# EAGLE design daq-beaglebone (EAGLE 7.3.0)
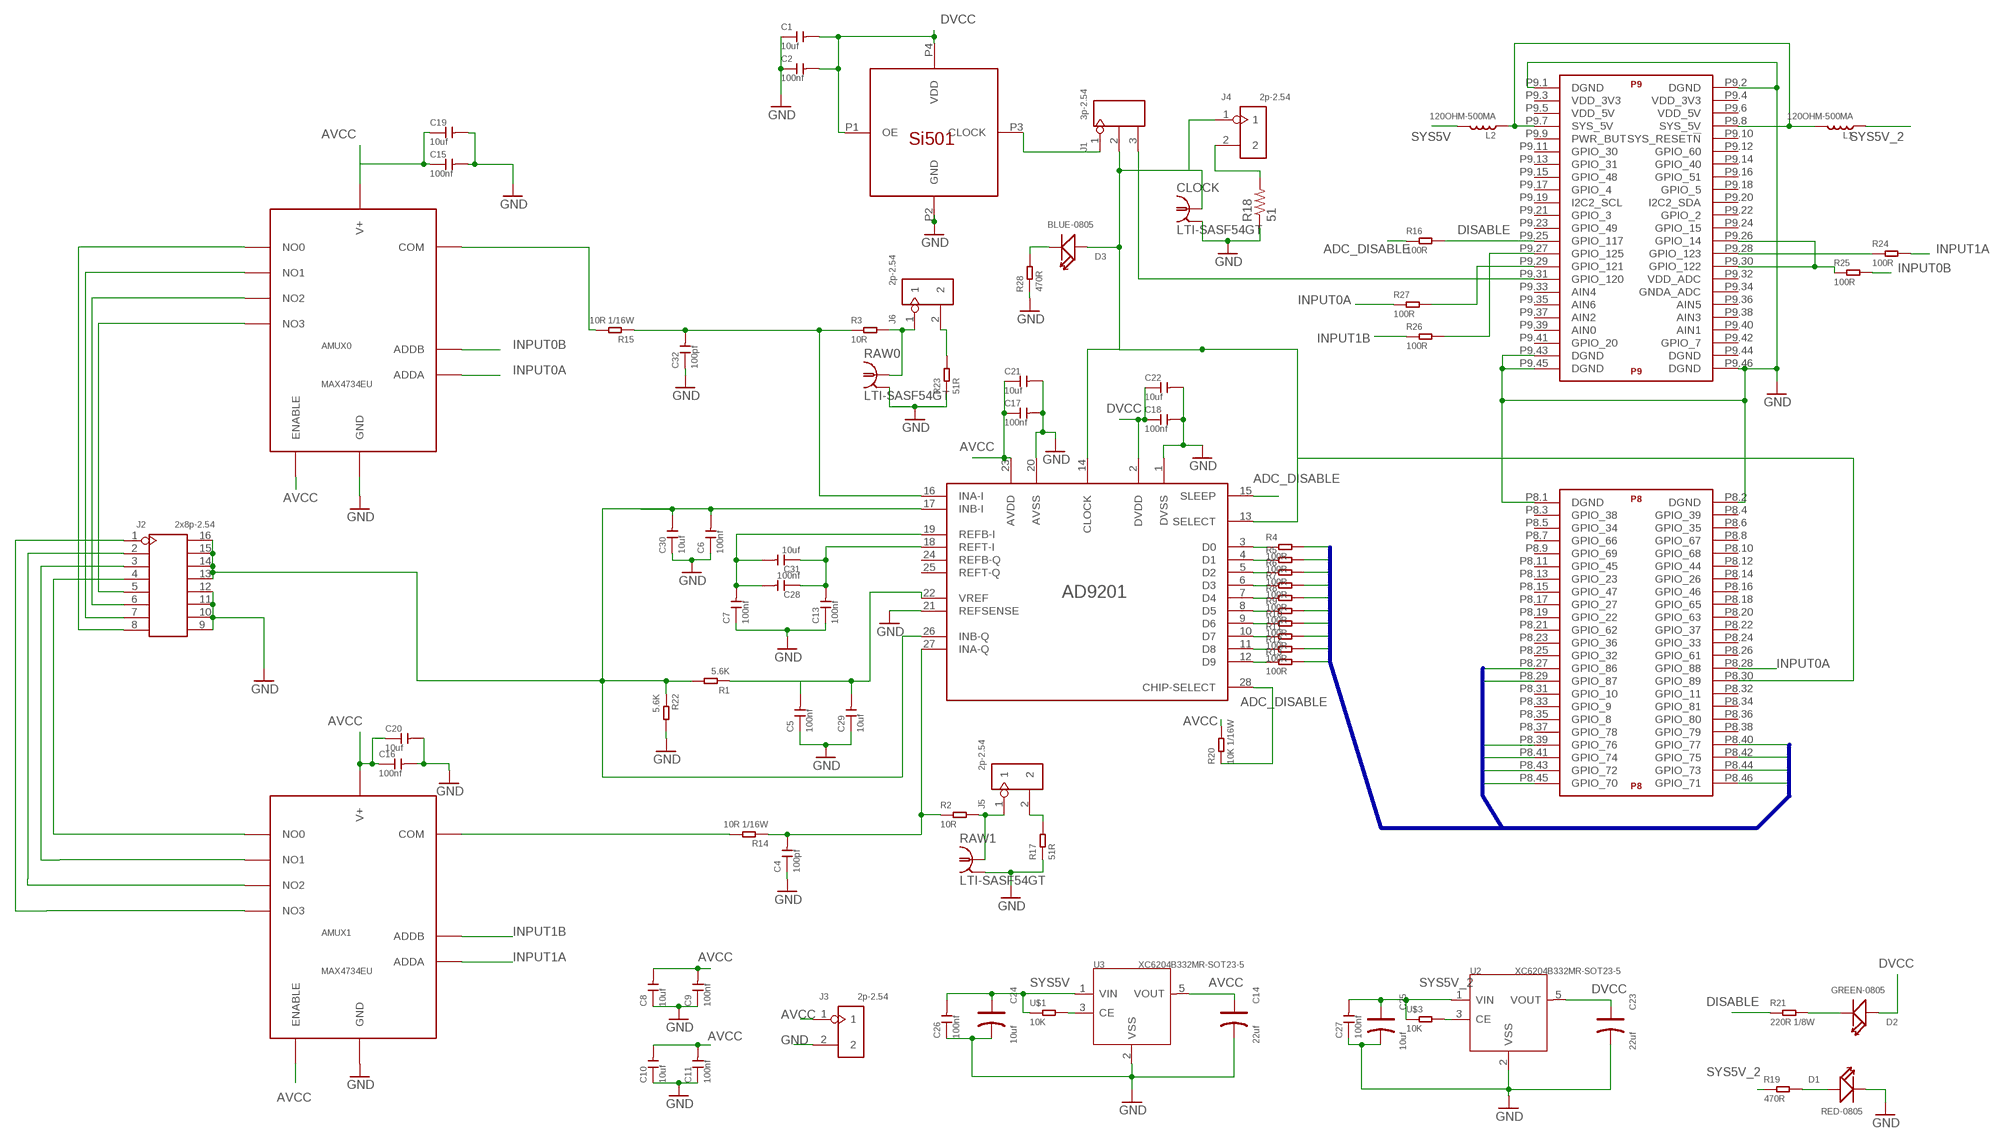
[diagram p0: schematic, sheet 1]

## Parts
AD9201  AD9201  [SSOP28]
AMUX0  MAX4734EU  [UMAX10]
AMUX1  MAX4734EU  [UMAX10]
C1  10uf  CERAMIC-10UF-6.3V-20%-X5R(0402)  [C0402]
C2  100nf  CERAMIC-100NF-25V-10%-X7R(0402)  [C0402]
C4  100pf  CERAMIC-100PF-50V-5%-NPO(0402)  [C0402]
C5  100nf  CERAMIC-100NF-25V-10%-X7R(0402)  [C0402]
C6  100nf  CERAMIC-100NF-25V-10%-X7R(0402)  [C0402]
C7  100nf  CERAMIC-100NF-25V-10%-X7R(0402)  [C0402]
C8  10uf  CERAMIC-10UF-6.3V-20%-X5R(0402)  [C0402]
C9  100nf  CERAMIC-100NF-25V-10%-X7R(0402)  [C0402]
C10  10uf  CERAMIC-10UF-6.3V-20%-X5R(0402)  [C0402]
C11  100nf  CERAMIC-100NF-25V-10%-X7R(0402)  [C0402]
C13  100nf  CERAMIC-100NF-25V-10%-X7R(0402)  [C0402]
C14  22uf  TANTALUM-SMD-22UF-6.3V(AVX-A)  [AVX-A]
C15  100nf  CERAMIC-100NF-25V-10%-X7R(0402)  [C0402]
C16  100nf  CERAMIC-100NF-25V-10%-X7R(0402)  [C0402]
C17  100nf  CERAMIC-100NF-25V-10%-X7R(0402)  [C0402]
C18  100nf  CERAMIC-100NF-25V-10%-X7R(0402)  [C0402]
C19  10uf  CERAMIC-10UF-6.3V-20%-X5R(0402)  [C0402]
C20  10uf  CERAMIC-10UF-6.3V-20%-X5R(0402)  [C0402]
C21  10uf  CERAMIC-10UF-6.3V-20%-X5R(0402)  [C0402]
C22  10uf  CERAMIC-10UF-6.3V-20%-X5R(0402)  [C0402]
C23  22uf  TANTALUM-SMD-22UF-6.3V(AVX-A)  [AVX-A]
C24  10uf  TANTALUM-SMD-10UF-10V-10%(AVX-A)  [AVX-A]
C25  10uf  TANTALUM-SMD-10UF-10V-10%(AVX-A)  [AVX-A]
C26  100nf  CERAMIC-100NF-25V-10%-X7R(0402)  [C0402]
C27  100nf  CERAMIC-100NF-25V-10%-X7R(0402)  [C0402]
C28  100nf  CERAMIC-100NF-25V-10%-X7R(0402)  [C0402]
C29  10uf  CERAMIC-10UF-6.3V-20%-X5R(0402)  [C0402]
C30  10uf  CERAMIC-10UF-6.3V-20%-X5R(0402)  [C0402]
C31  10uf  CERAMIC-10UF-6.3V-20%-X5R(0402)  [C0402]
C32  100pf  CERAMIC-100PF-50V-5%-NPO(0402)  [C0402]
CLOCK  LTI-SASF54GT  [LTI-SASF54GT]
D1  RED-0805  SMD-LED-CLEAR-RED(0805)  [LED-0805]
D2  GREEN-0805  SMD-LED-CLEAR-GREEN(0805)  [LED-0805]
D3  BLUE-0805  SMD-LED-CLEAR-RED(0805)  [LED-0805]
J1  3p-2.54  DIP-BLACK-FEMALE-HEADER-VERT(3P-2.54)  [H3-2.54]
J2  2x8p-2.54  DIP-BLACK-FEMALE-HEADER-VERT(2X8P-2.54)  [H2X8-2.54]
J3  2p-2.54  DIP-BLACK-FEMALE-HEADER-VERT(2P-2.54)  [H2-2.54]
J4  2p-2.54  DIP-BLACK-MALE-HEADER-VERT(2P-2.54)  [H2-2.54]
J5  2p-2.54  DIP-BLACK-MALE-HEADER-VERT(2P-2.54)  [H2-2.54]
J6  2p-2.54  DIP-BLACK-MALE-HEADER-VERT(2P-2.54)  [H2-2.54]
L1  120OHM-500MA  SMD-FERRITE-CHIP-120-OHM-500MA(0603)  [L0603]
L2  120OHM-500MA  SMD-FERRITE-CHIP-120-OHM-500MA(0603)  [L0603]
R1  5.6K  SMD-RES-5.6K-1%-1/10W(0402)  [R0402]
R2  10R  SMD-RES-0R-5%-1/16W(0402)  [R0402]
R3  10R  SMD-RES-0R-5%-1/16W(0402)  [R0402]
R4  100R  SMD-RES-100R-5%-1/16W(0402)  [R0402]
R5  100R  SMD-RES-100R-5%-1/16W(0402)  [R0402]
R6  100R  SMD-RES-100R-5%-1/16W(0402)  [R0402]
R7  100R  SMD-RES-100R-5%-1/16W(0402)  [R0402]
R8  100R  SMD-RES-100R-5%-1/16W(0402)  [R0402]
R9  100R  SMD-RES-100R-5%-1/16W(0402)  [R0402]
R10  100R  SMD-RES-100R-5%-1/16W(0402)  [R0402]
R11  100R  SMD-RES-100R-5%-1/16W(0402)  [R0402]
R12  100R  SMD-RES-100R-5%-1/16W(0402)  [R0402]
R13  100R  SMD-RES-100R-5%-1/16W(0402)  [R0402]
R14  10R 1/16W  SMD-RES-10R-1%-1/16W(0402)  [R0402]
R15  10R 1/16W  SMD-RES-10R-1%-1/16W(0402)  [R0402]
R16  100R  SMD-RES-100R-5%-1/16W(0402)  [R0402]
R17  51R  SMD-RES-51R-1%-1/10W(0603)  [R0603]
R18  51  R-US_R1206  [R1206]
R19  470R  SMD-RES-470R-1%-1/16W(0402)  [R0402]
R20  10K 1/16W  SMD-RES-10K-1%-1/16W(0402)  [R0402]
R21  220R 1/8W  SMD-RES-220R-1%-1/8W(0402)  [R0402]
R22  5.6K  SMD-RES-5.6K-1%-1/10W(0402)  [R0402]
R23  51R  SMD-RES-51R-1%-1/10W(0603)  [R0603]
R24  100R  SMD-RES-33R-1%-1/16W(0402)  [R0402]
R25  100R  SMD-RES-33R-1%-1/16W(0402)  [R0402]
R26  100R  SMD-RES-33R-1%-1/16W(0402)  [R0402]
R27  100R  SMD-RES-33R-1%-1/16W(0402)  [R0402]
R28  470R  SMD-RES-470R-1%-1/16W(0402)  [R0402]
RAW0  LTI-SASF54GT  [LTI-SASF54GT]
RAW1  LTI-SASF54GT  [LTI-SASF54GT]
U2  XC6204B332MR-SOT23-5  PMIC-XC6204B332MR(SOT23-5)  [SOT-23-5]
U3  XC6204B332MR-SOT23-5  PMIC-XC6204B332MR(SOT23-5)  [SOT-23-5]
U$1  10K  SMD-RES-10K-5%-1/(0402)  [R0402]
U$2  BEAGLE_BONE_BLACK_CAPE  [BEAGLE_BONE_BLACK_CAPE]
U$3  10K  SMD-RES-10K-5%-1/(0402)  [R0402]
U$4  SI501  [2X2.5DFN]

## Nets
ADC_DISABLE: AD9201.15(SLEEP) AD9201.28(CHIP-SELECT) R16.1 R20.1
AVCC: AD9201.23(AVDD) AMUX0.P$5(ENABLE) AMUX0.P$6(V+) AMUX1.P$5(ENABLE) AMUX1.P$6(V+) C8.2 C9.2 C10.2 C11.2 C14.+ C15.1 C16.1 C17.1 C19.1 C20.1 C21.1 J3.1 R20.2 U3.5(VOUT)
CLOCK: AD9201.13(SELECT) AD9201.14(CLOCK) CLOCK.1 D3.+ J1.2 J4.1 U$2.P8.30(P8:GPIO_89)
D0: R4.2 U$2.P8.45(P8:GPIO_70)
D1: R5.2 U$2.P8.46(P8:GPIO_71)
D2: R6.2 U$2.P8.43(P8:GPIO_72)
D3: R7.2 U$2.P8.44(P8:GPIO_73)
D4: R8.2 U$2.P8.41(P8:GPIO_74)
D5: R9.2 U$2.P8.42(P8:GPIO_75)
D6: R10.2 U$2.P8.39(P8:GPIO_76)
D7: R11.2 U$2.P8.40(P8:GPIO_77)
D8: R12.2 U$2.P8.27(P8:GPIO_86)
D9: R13.2 U$2.P8.29(P8:GPIO_87)
DISABLE: R16.2 R21.1 U$2.P9.25(P9:GPIO_117)
DVCC: AD9201.2(DVDD) C1.2 C2.2 C18.1 C22.1 C23.+ D2.+ U2.5(VOUT) U$4.P1(OE) U$4.P4(VDD)
GND: AD9201.1(DVSS) AD9201.20(AVSS) AD9201.21(REFSENSE) AMUX0.P$3(GND) AMUX1.P$3(GND) C1.1 C2.1 C4.1 C5.1 C6.1 C7.1 C8.1 C9.1 C10.1 C11.1 C13.1 C14.- C15.2 C16.2 C17.2 C18.2 C19.2 C20.2 C21.2 C22.2 C23.- C24.- C25.- C26.1 C27.1 C29.1 C30.1 C32.1 CLOCK.2 CLOCK.3 CLOCK.4 CLOCK.5 D1.- J2.9 J2.10 J2.11 J2.12 J3.2 R17.1 R18.1 R22.2 R23.1 R28.1 RAW0.2 RAW0.3 RAW0.4 RAW0.5 RAW1.2 RAW1.3 RAW1.4 RAW1.5 U2.2(VSS) U3.2(VSS) U$2.P8.1(P8:DGND) U$2.P8.2(P8:DGND) U$2.P9.1(P9:DGND) U$2.P9.2(P9:DGND) U$2.P9.43(P9:DGND) U$2.P9.45(P9:DGND) U$2.P9.46(P9:DGND) U$4.P2(GND)
INPUT0A: AMUX0.P$1(ADDA) R27.1 U$2.P8.28(P8:GPIO_88)
INPUT0B: AMUX0.P$10(ADDB) R25.2
INPUT1A: AMUX1.P$1(ADDA) R24.2
INPUT1B: AMUX1.P$10(ADDB) R26.1
N$1: AD9201.3(D0) R4.1
N$2: AD9201.4(D1) R5.1
N$3: AMUX0.P$2(NO0) J2.8
N$4: AD9201.17(INB-I) AD9201.26(INB-Q) C6.2 C30.2 J2.13 J2.14 J2.15 J2.16 R1.2 R22.1
N$5: AD9201.22(VREF) C5.2 C29.2 R1.1
N$6: AD9201.18(REFT-I) C13.2 C28.1 C31.1
N$7: AD9201.19(REFB-I) C7.2 C28.2 C31.2
N$8: AMUX0.P$9(NO1) J2.7
N$9: R25.1 U$2.P9.26(P9:GPIO_14) U$2.P9.30(P9:GPIO_122)
N$10: AMUX1.P$8(COM) R14.2
N$11: AD9201.16(INA-I) C32.2 R3.1 R15.1
N$12: AD9201.5(D2) R6.1
N$13: AD9201.6(D3) R7.1
N$14: AD9201.7(D4) R8.1
N$15: AD9201.8(D5) R9.1
N$16: AD9201.9(D6) R10.1
N$17: AD9201.10(D7) R11.1
N$18: AD9201.11(D8) R12.1
N$19: AD9201.12(D9) R13.1
N$20: J1.1 U$4.P3(CLOCK)
N$21: J1.3 U$2.P9.31(P9:GPIO_120)
N$22: AMUX0.P$8(COM) R15.2
N$23: AD9201.27(INA-Q) C4.2 R2.1 R14.1
N$24: R27.2 U$2.P9.29(P9:GPIO_121)
N$25: AMUX0.P$4(NO2) J2.6
N$26: AMUX0.P$7(NO3) J2.5
N$27: D1.+ R19.2
N$28: J5.1 R2.2 RAW1.1
N$29: AMUX1.P$4(NO2) J2.2
N$30: D3.- R28.2
N$33: D2.- R21.2
N$34: J6.1 R3.2 RAW0.1
N$35: J4.2 R18.2
N$36: U2.3(CE) U$3.2
N$37: U3.3(CE) U$1.2
N$38: R24.1 U$2.P9.28(P9:GPIO_123)
N$39: R26.2 U$2.P9.27(P9:GPIO_125)
N$40: J5.2 R17.2
N$41: J6.2 R23.2
N$44: AMUX1.P$2(NO0) J2.4
N$46: AMUX1.P$9(NO1) J2.3
N$47: AMUX1.P$7(NO3) J2.1
OTHERSYS5V: L1.2 L2.1 U$2.P9.7(P9:SYS_5V) U$2.P9.8(P9:SYS_5V)
SYS5V: C24.+ C26.2 L2.2 U3.1(VIN) U$1.1
SYS5V_2: C25.+ C27.2 L1.1 R19.1 U2.1(VIN) U$3.1
Unconnected: AD9201.24(REFB-Q) AD9201.25(REFT-Q) U$2.P8.3(P8:GPIO_38) U$2.P8.4(P8:GPIO_39) U$2.P8.5(P8:GPIO_34) U$2.P8.6(P8:GPIO_35) U$2.P8.7(P8:GPIO_66) U$2.P8.8(P8:GPIO_67) U$2.P8.9(P8:GPIO_69) U$2.P8.10(P8:GPIO_68) U$2.P8.11(P8:GPIO_45) U$2.P8.12(P8:GPIO_44) U$2.P8.13(P8:GPIO_23) U$2.P8.14(P8:GPIO_26) U$2.P8.15(P8:GPIO_47) U$2.P8.16(P8:GPIO_46) U$2.P8.17(P8:GPIO_27) U$2.P8.18(P8:GPIO_65) U$2.P8.19(P8:GPIO_22) U$2.P8.20(P8:GPIO_63) U$2.P8.21(P8:GPIO_62) U$2.P8.22(P8:GPIO_37) U$2.P8.23(P8:GPIO_36) U$2.P8.24(P8:GPIO_33) U$2.P8.25(P8:GPIO_32) U$2.P8.26(P8:GPIO_61) U$2.P8.31(P8:GPIO_10) U$2.P8.32(P8:GPIO_11) U$2.P8.33(P8:GPIO_9) U$2.P8.34(P8:GPIO_81) U$2.P8.35(P8:GPIO_8) U$2.P8.36(P8:GPIO_80) U$2.P8.37(P8:GPIO_78) U$2.P8.38(P8:GPIO_79) U$2.P9.3(P9:VDD_3V3) U$2.P9.4(P9:VDD_3V3) U$2.P9.5(P9:VDD_5V) U$2.P9.6(P9:VDD_5V) U$2.P9.9(P9:PWR_BUT) U$2.P9.10(P9:SYS_RESET!N) U$2.P9.11(P9:GPIO_30) U$2.P9.12(P9:GPIO_60) U$2.P9.13(P9:GPIO_31) U$2.P9.14(P9:GPIO_40) U$2.P9.15(P9:GPIO_48) U$2.P9.16(P9:GPIO_51) U$2.P9.17(P9:GPIO_4) U$2.P9.18(P9:GPIO_5) U$2.P9.19(P9:I2C2_SCL) U$2.P9.20(P9:I2C2_SDA) U$2.P9.21(P9:GPIO_3) U$2.P9.22(P9:GPIO_2) U$2.P9.23(P9:GPIO_49) U$2.P9.24(P9:GPIO_15) U$2.P9.32(P9:VDD_ADC) U$2.P9.33(P9:AIN4) U$2.P9.34(P9:GNDA_ADC) U$2.P9.35(P9:AIN6) U$2.P9.36(P9:AIN5) U$2.P9.37(P9:AIN2) U$2.P9.38(P9:AIN3) U$2.P9.39(P9:AIN0) U$2.P9.40(P9:AIN1) U$2.P9.41(P9:GPIO_20) U$2.P9.42(P9:GPIO_7) U$2.P9.44(P9:DGND)

## Buses
D0,D1,D2,D3,D4,D5,D6,D7,D8,D9

## Library data of the parts
AD9201 = sam_parts:AD9201: AD9201 Dual Channel, 20 MHz 10-Bit Resolution CMOS ADC
AMUX0 AMUX1 = jholt:MAX4734EU: 4:1 analog switch in uMax 10 package
C1 C8 C10 C19-C22 C29-C31 = Seeed-OPL-Capacitor:CERAMIC-10UF-6.3V-20%-X5R(0402): 302010053; MPN: CC0402MRX5R5BB106
C2 C5-C7 C9 C11 C13 C15-C18 C26-C28 = Seeed-OPL-Capacitor:CERAMIC-100NF-25V-10%-X7R(0402): 302010024; MPN: CC0402KRX7R8BB104
C4 C32 = Seeed-OPL-Capacitor:CERAMIC-100PF-50V-5%-NPO(0402): 302010012; MPN: CC0402JRNPO9BN101
C14 C23 = Seeed-OPL-Capacitor:TANTALUM-SMD-22UF-6.3V(AVX-A): 302020009; MPN: TAJA226K006RNJ
C24 C25 = Seeed-OPL-Capacitor:TANTALUM-SMD-10UF-10V-10%(AVX-A): 302020011; MPN: TAJA106K010RNJ
CLOCK RAW0 RAW1 = con-coax:LTI-SASF54GT: SMA vertical PCB thrue hole jack Source: Lighthorse Technologies, inc. SASF54GT.pdf; OC_FARNELL: unknown; OC_NEWARK: unknown
D1 = Seeed-OPL-Diode:SMD-LED-CLEAR-RED(0805): 304090046; MPN: 17-215SURC/S530-A2/TR8
D2 = Seeed-OPL-Diode:SMD-LED-CLEAR-GREEN(0805): 304090057; MPN: 17-215SYGC/S530-E2/TR8
D3 = Seeed-OPL-Diode:SMD-LED-CLEAR-RED(0805): 304090046; MPN: 17-215SURC/S530-A2/TR8; VALUE: RED-0805
J1 = Seeed-OPL-Connector:DIP-BLACK-FEMALE-HEADER-VERT(3P-2.54): 320030024; MPN: F185-1103A0BSYA1
J2 = Seeed-OPL-Connector:DIP-BLACK-FEMALE-HEADER-VERT(2X8P-2.54): 320030080; MPN: F185-1216A0BSYA1
J3 = Seeed-OPL-Connector:DIP-BLACK-FEMALE-HEADER-VERT(2P-2.54): 320030023; MPN: F185-1102A1BSYA1
J4-J6 = Seeed-OPL-Connector:DIP-BLACK-MALE-HEADER-VERT(2P-2.54): 320020016; MPN: P125-1102A0BS116A1
L1 L2 = Seeed-OPL-Inductor:SMD-FERRITE-CHIP-120-OHM-500MA(0603): 303030001; MPN: BLM18AG121SN1D
R1 R22 = Seeed-OPL-Resistor:SMD-RES-5.6K-1%-1/10W(0402): 301010546; MPN: CRCW04025K60FKED
R2 R3 = Seeed-OPL-Resistor:SMD-RES-0R-5%-1/16W(0402): 301010000; MPN: RC0402JR-070RL; VALUE: 0R
R4-R13 R16 = Seeed-OPL-Resistor:SMD-RES-100R-5%-1/16W(0402): 301010028; MPN: RC0402JR-07100RL
R14 R15 = Seeed-OPL-Resistor:SMD-RES-10R-1%-1/16W(0402): 301010444; MPN: RC0402FR-0710RL
R17 R23 = Seeed-OPL-Resistor:SMD-RES-51R-1%-1/10W(0603): 301010225; MPN: RC0603FR-0751RL
R18 = resistor:R-US_: RESISTOR, American symbol
R19 R28 = Seeed-OPL-Resistor:SMD-RES-470R-1%-1/16W(0402): 301010012; MPN: RC0402FR-07470RL
R20 = Seeed-OPL-Resistor:SMD-RES-10K-1%-1/16W(0402): 301010047; MPN: RC0402FR-0710KL
R21 = Seeed-OPL-Resistor:SMD-RES-220R-1%-1/8W(0402): 301010550; MPN: RC0402FR-07220RL
R24-R27 = Seeed-OPL-Resistor:SMD-RES-33R-1%-1/16W(0402): 301010609; MPN: RC0402FR-0733RL; VALUE: 33R
U2 U3 = Seeed-OPL-ic:PMIC-XC6204B332MR(SOT23-5): 310030106; MPN: XC6204B332MR
U$1 U$3 = Seeed-OPL-Resistor:SMD-RES-10K-5%-1/(0402): 301010004; MPN: RC0402JR-0710KL
U$2 = SparkFun-Boards:BEAGLE_BONE_BLACK_CAPE
U$4 = jholt:SI501: 501JCA20M0000DAFR

## Board
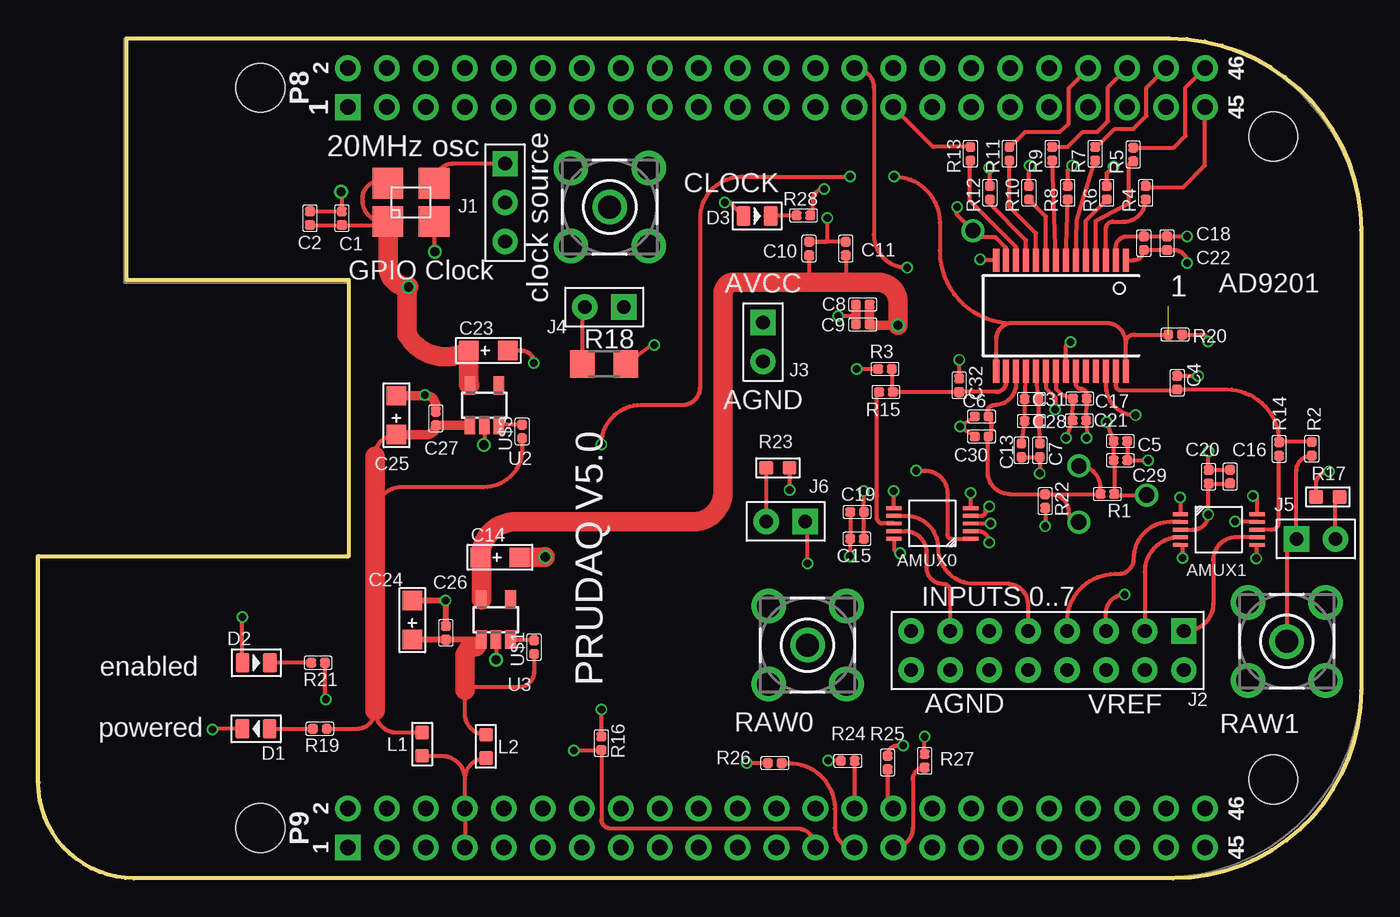
[diagram p1: board, top side]
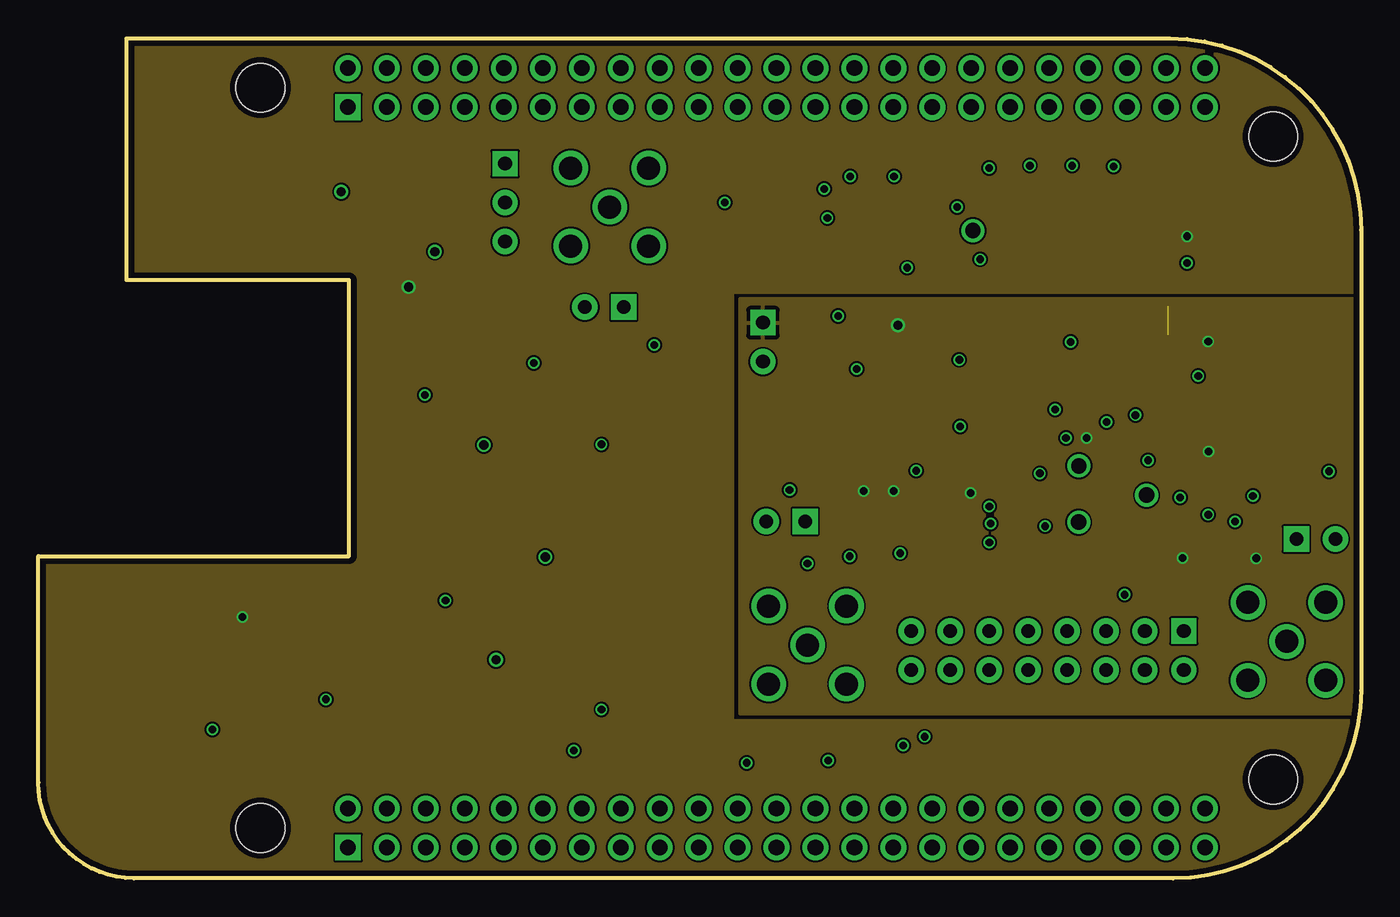
[diagram p2: board, inner layer Route2]
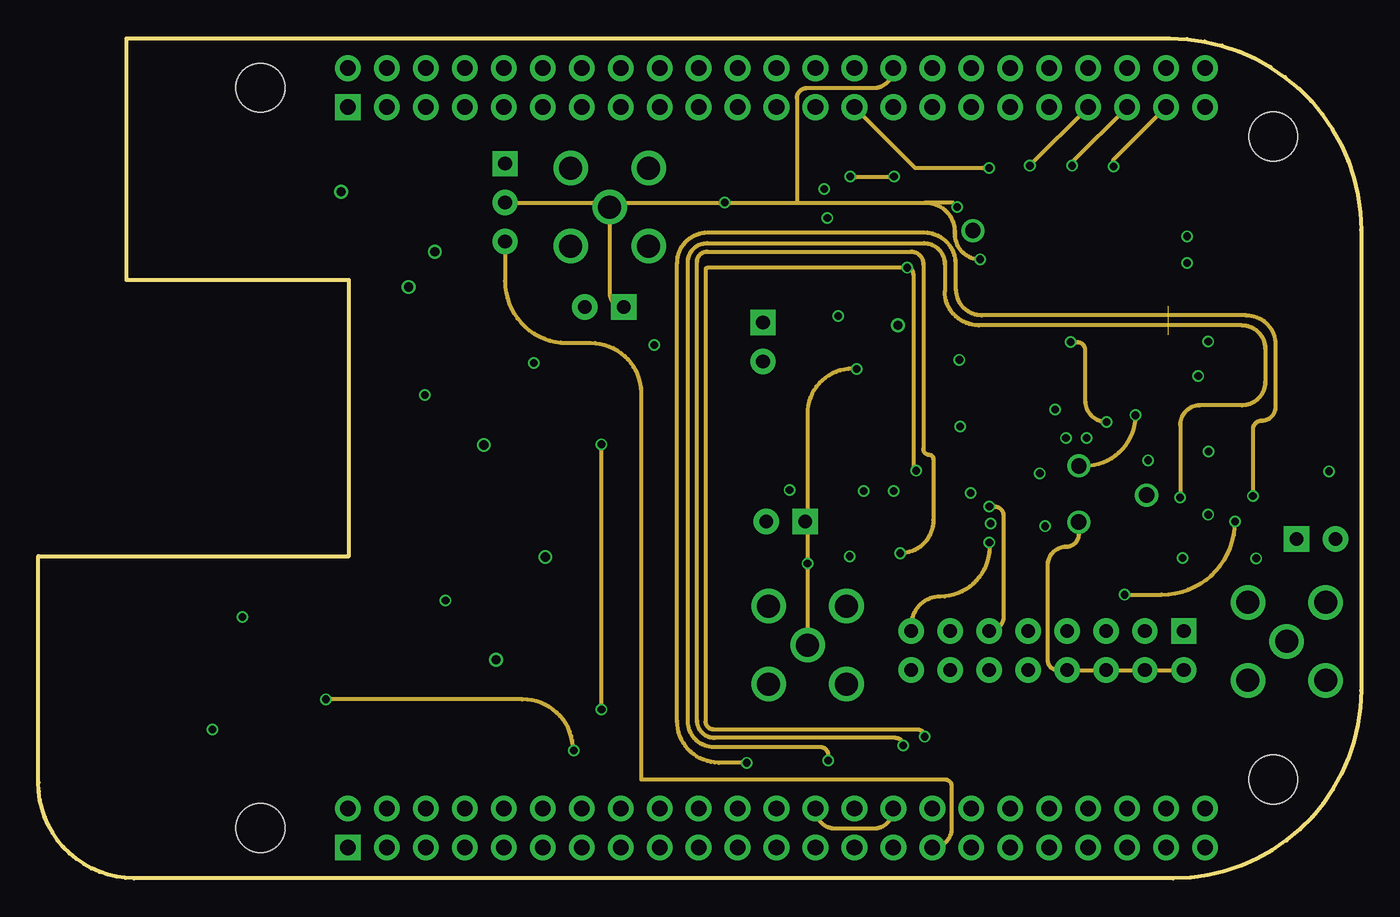
[diagram p3: board, inner layer Route15]
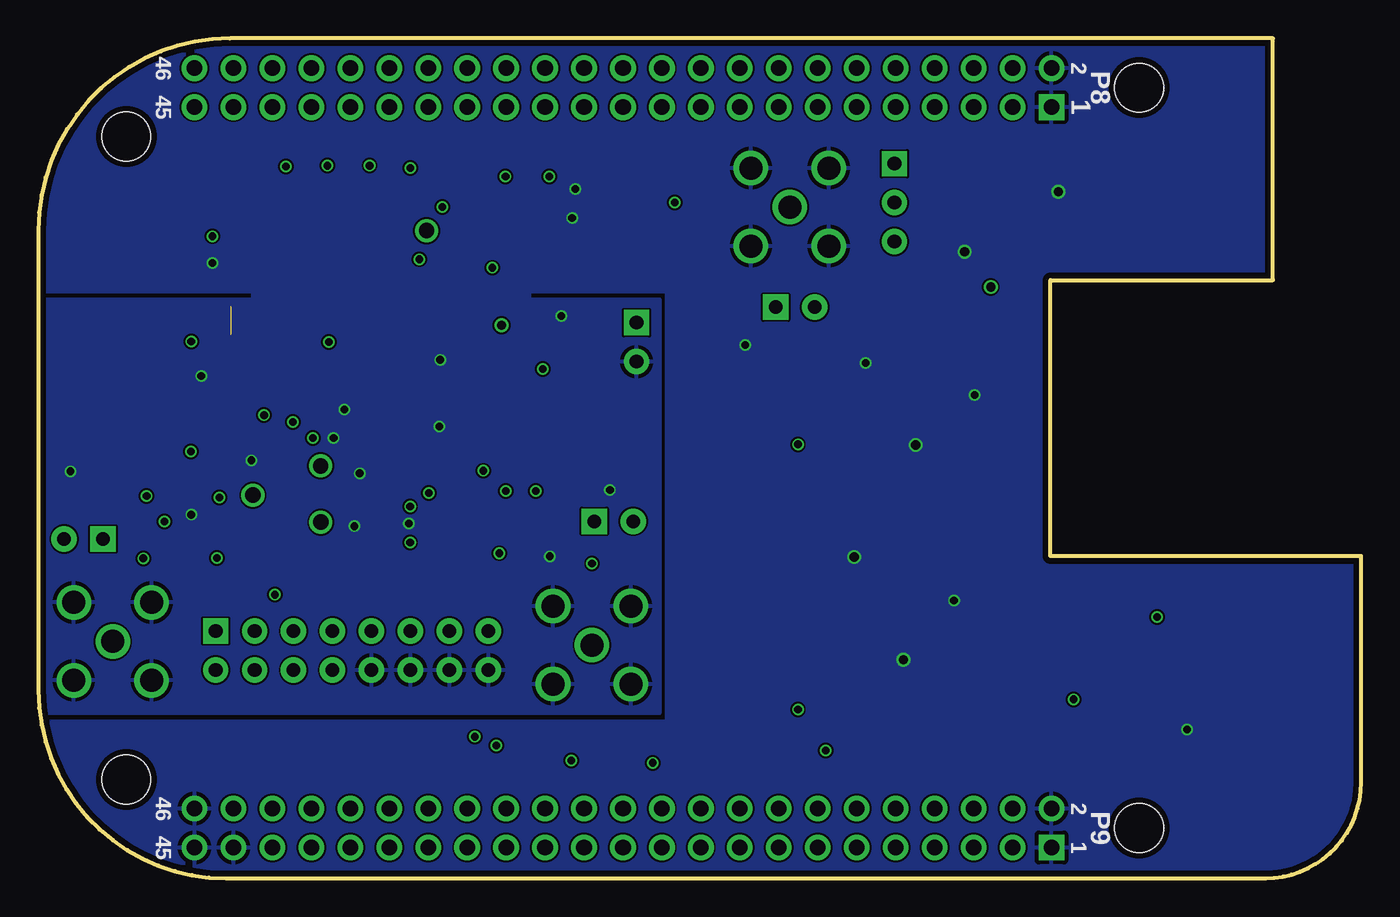
[diagram p4: board, bottom side, seen from below]

Size 86.25 x 54.75 mm. Coordinates in mm from the lower left corner, seen from the top.
Outline: 0,21 20.25,21 20.25,39 5.75,39 5.75,54.75 73.75,54.75 arc-90 86.25,42.25 86.25,12.25 arc-90 74,0 6.25,0 arc-90 0,6.25 0,21
Copper layers (1*2*15*16): Top 0.035559375mm / dielectric 0.17018125mm / Route2 0.01778125mm / dielectric 47mil / Route15 0.01778125mm / dielectric 0.17018125mm / Bottom 0.035559375mm
Design rules "OSHPark-4layer": minimum track width 5mil, minimum drill 10mil, track to track 5mil, track to pad 5mil, pad to pad 5mil, via to via 5mil, smd to smd 5mil, copper to edge 15mil, drill to drill 6mil, minimum pad ring 4mil, minimum via ring 4mil, stop-mask expansion 2.5mil, vias tented up to drill 0mil, thermal gap 10mil

### Footprints (pad centres in the part's own frame; a part is rotated, then mirrored left to right if it is on the bottom)
SSOP28 = smd 0.4 x 1.5: 1 -4.225,-3.625; 2 -3.575,-3.625; 3 -2.925,-3.625; 4 -2.275,-3.625; 5 -1.625,-3.625; 6 -0.975,-3.625; 7 -0.325,-3.625; 8 0.325,-3.625; 9 0.975,-3.625; 10 1.625,-3.625; 11 2.275,-3.625; 12 2.925,-3.625; 13 3.575,-3.625; 14 4.225,-3.625; 15 4.225,3.625; 16 3.575,3.625; 17 2.925,3.625; 18 2.275,3.625; 19 1.625,3.625; 20 0.975,3.625; 21 0.325,3.625; 22 -0.325,3.625; 23 -0.975,3.625; 24 -1.625,3.625; 25 -2.275,3.625; 26 -2.925,3.625; 27 -3.575,3.625; 28 -4.225,3.625
UMAX10 = smd 1 x 0.25: P$1 -0.5,0; P$2 -0.5,-0.5; P$3 -0.5,-1; P$4 -0.5,-1.5; P$5 -0.5,-2; P$6 4.5,-2; P$7 4.5,-1.5; P$8 4.5,-1; P$9 4.5,-0.5; P$10 4.5,0
C0402 = smd 0.635 x 0.635: 1 0,0.445; 2 0,-0.445
AVX-A = smd 1.27 x 1.27: + -1.27,0; - 1.27,0
LTI-SASF54GT = drill 1.5 pad 2.2: 1 0,0; 2 -2.54,2.54; 3 2.54,2.54; 4 2.54,-2.54; 5 -2.54,-2.54
LED-0805 = smd 0.889 x 1.27: + -0.889,0; - 0.889,0
H3-2.54 = drill 0.889 pad 1.651 square: 1 0,2.54 | drill 0.889 pad 1.651: 2 0,0; 3 0,-2.54
H2X8-2.54 = drill 0.889 pad 1.651 square: 1 -1.27,8.89 | drill 0.889 pad 1.651: 2 -1.27,6.35; 3 -1.27,3.81; 4 -1.27,1.27; 5 -1.27,-1.27; 6 -1.27,-3.81; 7 -1.27,-6.35; 8 -1.27,-8.89; 9 1.27,-8.89; 10 1.27,-6.35; 11 1.27,-3.81; 12 1.27,-1.27; 13 1.27,1.27; 14 1.27,3.81; 15 1.27,6.35; 16 1.27,8.89
H2-2.54 = drill 0.889 pad 1.651 square: 1 0,1.27 | drill 0.889 pad 1.651: 2 0,-1.27
L0603 = smd 0.889 x 0.889: 1 -0.762,0; 2 0.762,0
R0402 = smd 0.635 x 0.635: 1 0,0.445; 2 0,-0.445
R0603 = smd 0.889 x 0.889: 1 0,0.762; 2 0,-0.762
R1206 = smd 1.6 x 1.803: 1 -1.422,0; 2 1.422,0
SOT-23-5 = smd 0.69 x 1.2: 1 -0.95,-1.3; 2 0,-1.3; 3 0.95,-1.3; 4 0.95,1.3; 5 -0.95,1.3
BEAGLE_BONE_BLACK_CAPE = drill 1.016 pad 1.676 square: P8.1 20.32,50.165; P9.1 20.32,1.905 | drill 1.016 pad 1.676: P8.2 20.32,52.705; P8.3 22.86,50.165; P8.4 22.86,52.705; P8.5 25.4,50.165; P8.6 25.4,52.705; P8.7 27.94,50.165; P8.8 27.94,52.705; P8.9 30.48,50.165; P8.10 30.48,52.705; P8.11 33.02,50.165; P8.12 33.02,52.705; P8.13 35.56,50.165; P8.14 35.56,52.705; P8.15 38.1,50.165; P8.16 38.1,52.705; P8.17 40.64,50.165; P8.18 40.64,52.705; P8.19 43.18,50.165; P8.20 43.18,52.705; P8.21 45.72,50.165; P8.22 45.72,52.705; P8.23 48.26,50.165; P8.24 48.26,52.705; P8.25 50.8,50.165; P8.26 50.8,52.705; P8.27 53.34,50.165; P8.28 53.34,52.705; P8.29 55.88,50.165; P8.30 55.88,52.705; P8.31 58.42,50.165; P8.32 58.42,52.705; P8.33 60.96,50.165; P8.34 60.96,52.705; P8.35 63.5,50.165; P8.36 63.5,52.705; P8.37 66.04,50.165; P8.38 66.04,52.705; P8.39 68.58,50.165; P8.40 68.58,52.705; P8.41 71.12,50.165; P8.42 71.12,52.705; P8.43 73.66,50.165; P8.44 73.66,52.705; P8.45 76.2,50.165; P8.46 76.2,52.705; P9.2 20.32,4.445; P9.3 22.86,1.905; P9.4 22.86,4.445; P9.5 25.4,1.905; P9.6 25.4,4.445; P9.7 27.94,1.905; P9.8 27.94,4.445; P9.9 30.48,1.905; P9.10 30.48,4.445; P9.11 33.02,1.905; P9.12 33.02,4.445; P9.13 35.56,1.905; P9.14 35.56,4.445; P9.15 38.1,1.905; P9.16 38.1,4.445; P9.17 40.64,1.905; P9.18 40.64,4.445; P9.19 43.18,1.905; P9.20 43.18,4.445; P9.21 45.72,1.905; P9.22 45.72,4.445; P9.23 48.26,1.905; P9.24 48.26,4.445; P9.25 50.8,1.905; P9.26 50.8,4.445; P9.27 53.34,1.905; P9.28 53.34,4.445; P9.29 55.88,1.905; P9.30 55.88,4.445; P9.31 58.42,1.905; P9.32 58.42,4.445; P9.33 60.96,1.905; P9.34 60.96,4.445; P9.35 63.5,1.905; P9.36 63.5,4.445; P9.37 66.04,1.905; P9.38 66.04,4.445; P9.39 68.58,1.905; P9.40 68.58,4.445; P9.41 71.12,1.905; P9.42 71.12,4.445; P9.43 73.66,1.905; P9.44 73.66,4.445; P9.45 76.2,1.905; P9.46 76.2,4.445 | hole 3.175: 14.605,3.175; 80.645,6.35; 80.645,48.26; 14.605,51.435
2X2.5DFN = smd 2 x 2: P1 -0.25,-2.25; P2 2.75,-2.25; P3 2.75,0.25; P4 -0.25,0.25

### Placement (x,y rotation side)
AD9201  66.67,36.68 180 top
AMUX0  60.29,22.13 180 top
AMUX1  74.96,23.73 0 top
C1  19.79,43.03 0 top
C2  17.71,43.03 0 top
C4  74.26,32.31 0 top
C5  70.55,28.5 270 top
C6  61.5,30.1 90 top
C7  65.3,27.9 180 top
C8  53.75,37.4 90 top
C9  53.75,36.1 90 top
C10  50.25,41.05 0 top
C11  52.65,41.05 0 top
C13  64.1,27.9 180 top
C14  30.1,20.93 0 top
C15  53.38,22.13 270 top
C16  77.71,26.19 0 top
C17  67.91,31.27 270 top
C18  73.59,41.4 0 top
C19  53.39,23.88 270 top
C20  76.3,26.18 0 top
C21  67.88,29.85 270 top
C22  72.08,41.4 0 top
C23  29.33,34.41 0 top
C24  24.38,16.83 90 top
C25  23.35,30.19 90 top
C26  26.57,16 0 top
C27  25.92,29.98 0 top
C28  64.75,29.8 90 top
C29  70.55,27.25 270 top
C30  61.5,28.8 90 top
C31  64.75,31.25 90 top
C32  60.04,32.14 0 top
CLOCK  37.25,43.75 0 top
D1  14.2,9.75 180 top
D2  14.21,14.05 0 top
D3  46.87,43.17 0 top
J1  30.43,44.04 0 top
J2  65.8,14.85 270 top
J3  47.25,34.95 0 top
J4  36.9,37.23 270 top
J5  83.3,22.12 90 top
J6  48.73,23.27 270 top
L1  25.03,8.75 270 top
L2  29.19,8.6 90 top
R1  69.7,25.05 270 top
R2  83.03,28 0 top
R3  55.2,33.2 270 top
R4  72.2,44.69 180 top
R5  71.39,47.18 180 top
R6  69.66,44.69 180 top
R7  68.9,47.23 180 top
R8  67.12,44.69 180 top
R9  66.11,47.23 180 top
R10  64.58,44.69 180 top
R11  63.31,47.23 180 top
R12  62.04,44.69 180 top
R13  60.77,47.23 180 top
R14  80.9,27.99 0 top
R15  55.26,31.7 270 top
R16  36.71,8.81 0 top
R17  84.07,24.86 90 top
R18  36.89,33.53 180 top
R19  18.35,9.75 270 top
R20  74.12,35.44 90 top
R21  18.25,14.05 270 top
R22  65.65,24.59 0 top
R23  48.22,26.76 270 top
R24  52.78,7.66 270 top
R25  55.37,7.55 180 top
R26  48.02,7.51 90 top
R27  57.79,7.66 0 top
R28  49.89,43.21 270 top
RAW0  50.15,15.2 0 top
RAW1  81.4,15.45 0 top
U2  29.08,30.83 0 top
U3  29.84,16.86 0 top
U$1  32.32,15.07 180 top
U$2  -0.13,0.1 0 top
U$3  31.54,29.13 180 top
U$4  23.05,45.06 0 top

### Tracks (layer width: path | path; a pad name or v marks a point on that pad's centre or on a via)
ADC_DISABLE  (via drill 0.5 pad 0.25)  (1 unrouted)
  Top 0.254: 62.45,35.05 arc-90 62.45,35.05 | v36.72,28.29 arc-90 39.29,30.86 41.99,30.86 arc90 43.16,32.03 43.16,43.02 arc-90 45.88,45.74 v52.94,45.74 | v55.79,45.74 arc-90 58.77,42.76 58.77,40.92 arc90 63.5,36.19 | 62.45,35.05 AD9201.15 | AD9201.28 arc90 70.91,33.06 70.91,34.9 | 70.91,34.9 arc90 69.62,36.19 63.5,36.19 | 63.5,36.19 arc90 62.45,35.13 | 62.45,35.13 62.45,35.05 | 62.45,35.13 arc90 62.45,35.14 | R16.1 arc90 36.72,9.26 v36.72,11 | 70.91,34.9 arc-90 71.45,35.44 R20.1
  Route15 0.254: v36.72,11 v36.72,28.29 | v52.94,45.74 v55.79,45.74
AVCC  (via drill 0.5 pad 0.25, 0.6)
  Top 0.254: v68.35,28.7 C21.1 C17.1 68.35,31.53 arc90 67.96,31.92 arc-90 67.65,32.23 AD9201.23 | C10.2 50.25,38.9 arc90 50.3,38.85 | C11.2 52.65,38.9 arc-90 52.6,38.85 | C15.1 C19.1 | C19.1 arc-90 C19.1 | AMUX0.P$5 v60.79,25.11 | R20.2 75.84,35.44 arc-90 v76.28,35 | C16.1 arc-90 77.7,26.62 C20.1 v76.3,27.83 arc-90 v76.3,27.83 | 74.09,21.73 AMUX1.P$5 arc-90 74.6,21.59 v74.6,20.89 | C19.1 53.82,25.24 arc90 v53.81,25.25 | AMUX0.P$6 v55.79,25.24 arc90 v55.78,25.25 | AMUX1.P$6 arc90 79.41,21.68 v79.41,20.86
  Top 0.61: C8.2 C9.2 arc90 54.24,36.05 v56.05,36.05
  Top 1.27: U3.5 28.89,20.93 C14.+ arc-90 31.15,23.25 42.7,23.25 arc90 44.65,25.2 44.65,38.15 arc-90 45.35,38.85 50.3,38.85 52.6,38.85 54.75,38.85 arc-90 56.05,37.55 v56.05,36.05
  pour Route2: 45.75,10.75 88.25,10.75 88.25,37.75 45.75,37.75
CLOCK  (via drill 0.5 pad 0.25, 1 pad 1.27)
  Top 0.254: AD9201.14 61.45,40.3 arc-90 v61.4,40.35 | AD9201.13 63.1,41.1 62.41,41.79 61.37,41.79 v60.94,42.22 59.9,43.26 v59.9,43.75 | D3.+ 45.11,44.04 v44.75,44.04
  Route15 0.254: U$2.P8.30 arc-90 54.45,51.5 50.1,51.5 arc90 49.45,50.85 49.45,44.04 | 49.45,44.04 arc-90 49.46,44.05 57.83,44.05 | J1.2 37.23,44.04 | 37.23,44.04 44.61,44.04 v44.75,44.04 49.45,44.04 | J4.1 arc-90 37.25,38.15 CLOCK.1 37.25,44.02 arc90 37.23,44.04 | 57.83,44.05 arc-90 59.75,42.13 59.75,42 arc90 v61.4,40.35 | v59.9,43.75 59.6,44.05 57.83,44.05
D0
  Top 0.254: R4.2 72.28,45.05 74.65,45.05 76.07,46.47 U$2.P8.45
D1
  Top 0.254: R5.2 74.02,47.62 74.8,48.4 74.8,51.53 U$2.P8.46
D2  (via drill 0.5 pad 0.25)
  Top 0.254: R6.2 69.66,45.96 v70.1,46.4
  Route15 0.254: v70.1,46.4 70.1,46.84 U$2.P8.43
D3
  Top 0.254: R7.2 69.02,47.67 70.2,48.85 71.4,48.85 72.25,49.7 72.25,51.52 U$2.P8.44
D4  (via drill 0.5 pad 0.25)
  Top 0.254: R8.2 67.12,46.17 v67.4,46.45
  Route15 0.254: v67.4,46.45 67.4,46.67 U$2.P8.41
D5
  Top 0.254: R9.2 67.12,47.67 68.1,48.65 69.05,48.65 69.75,49.35 69.75,51.56 U$2.P8.42
D6  (via drill 0.5 pad 0.25)
  Top 0.254: R10.2 64.58,46.38 v64.65,46.45
  Route15 0.254: v64.65,46.45 64.65,46.47 U$2.P8.39
D7
  Top 0.254: R11.2 63.37,47.67 64.35,48.65 66.6,48.65 67.18,49.19 67.18,51.49 U$2.P8.40
D8  (via drill 0.5 pad 0.25)
  Top 0.254: R12.2 62.04,46.26 v62,46.3
  Route15 0.254: v62,46.3 57.17,46.3 U$2.P8.27
D9
  Top 0.254: R13.2 58.34,47.67 U$2.P8.29
DISABLE  (via drill 0.5 pad 0.25)
  Top 0.254: v34.91,8.33 36.67,8.33 arc90 R16.2 36.71,3.85 arc90 37.3,3.26 49.41,3.26 arc-90 U$2.P9.25 | v18.75,11.67 arc-90 18.7,11.73 R21.1
  Route15 0.254: v34.91,8.33 arc-90 34.87,8.37 arc90 31.57,11.67 v18.75,11.67
DVCC  (via drill 0.5 pad 0.25, 0.6)
  Top 0.254: C2.2 C1.2 22.57,42.58 arc90 U$4.P1 22.49,42.81 arc-90 21.15,44.15 21.15,44.35 arc-90 22.25,45.45 22.66,45.45 arc-90 U$4.P4 | AD9201.2 70.25,41.1 arc-90 71,41.85 C22.1 arc-90 C22.1 C18.1 v74.89,41.84 arc90 v74.9,41.85 | D2.+ arc-90 13.3,14.07 v13.3,17.03
  Top 1.27: U2.5 arc-90 28.06,32.2 C23.+ arc-90 24.05,35.42 24.05,38.55 v24.15,38.55 arc-90 22.8,39.9 U$4.P1
  pour Route2: 88.25,10.25 45.25,10.25 45.25,38.25 88.25,38.25 88.25,55.75 -1.75,55.75 -1.75,-2.25 88.25,-2.25
GND  (via drill 0.5 pad 0.25, 0.6)
  Top 0.254: U$4.P2 25.8,40.9 arc-90 25.75,40.85 v25.85,40.85 | C2.1 C1.1 19.79,44.71 arc90 v19.75,44.75 | U3.2 29.84,14.16 arc90 29.85,14.15 v29.85,14.25 | U2.2 29.08,28.28 arc-90 v29.05,28.25 | AD9201.1 71.42,40.3 arc90 C22.2 C18.2 74.04,40.96 arc-90 v74.9,40.1 | C29.1 C5.1 C29.1 arc90 C29.1 v72.35,27.25 | AD9201.21 66.35,31.9 66.7,31.55 C17.2 C21.2 v67,28.7 | C13.1 C7.1 v65.3,26.4 | C6.1 v60.1,29.45 C30.1 | C11.1 C10.1 51.44,41.49 arc90 51.45,41.5 v51.45,43.05 | C8.1 53.31,36.66 53.3,36.65 v52.15,36.65 | D1.- 11.35,9.75 v11.35,9.7 | C23.- 31.49,34.41 arc-90 v32.3,33.6 | AD9201.20 65.7,31.95 66.3,31.35 v66.3,30.55 | C19.2 52.94,22.14 arc-90 C15.2 52.93,20.98 arc-90 52.91,20.96 v52.91,20.99 | AMUX0.P$3 62.12,23.13 arc-90 62.13,23.14 62.11,23.14 arc90 v62.09,23.12 | R18.1 40.09,34.84 arc-90 v40.17,34.76 | R22.2 v65.65,22.95 | C16.2 arc-90 77.7,25.73 C20.2 arc90 76.28,25.71 v76.28,23.7 arc-90 75.31,22.73 AMUX1.P$3 | C4.1 v75.63,32.76 arc-90 v75.63,32.75 | C32.1 v60.04,33.79 arc-90 v60.05,33.8 | R17.1 83.31,25.69 arc-90 v84.15,26.53 | R23.1 v48.98,25.31 arc-90 v48.98,25.31 | R28.1 50.49,43.05 50.49,44.19 arc-90 v51.23,44.93
  Top 0.406: C26.1 26.57,18.08 arc90 v26.55,18.1 C24.-
  Top 0.61: C25.- 25.16,31.46 arc90 v25.2,31.5 arc-90 25.92,30.78 C27.1 | C9.1 C8.1
  Top 1.27: C14.- 33.03,20.93 arc90 v33.05,20.95
  Bottom 0.254: RAW0.4 53.34,12.66
  pour Bottom: 72.25,38.25 87.25,38.25 87.25,56.75 -2.75,56.75 -2.75,-1.25 87.25,-1.25 87.25,10.25 45.25,10.25 45.25,38.25 54.25,38.25 54.25,37.75 45.75,37.75 45.75,10.75 87.25,10.75 87.25,37.75 72.25,37.75
INPUT0A  (via drill 0.5 pad 0.25)
  Top 0.254: U$2.P8.28 arc-90 54.48,51.53 54.48,41.97 arc90 v56.65,39.8 | v57.23,26.57 57.83,26.57 arc-90 59.27,25.13 59.27,22.4 arc90 59.53,22.14 AMUX0.P$1 arc-90 AMUX0.P$1 | R27.1 v57.79,9.23
  Route15 0.254: 43.5,10.25 43.5,39.65 arc-90 43.65,39.8 v56.65,39.8 arc-90 57.05,39.4 57.05,26.75 arc90 v57.23,26.57 | 43.5,10.25 43.5,10.05 | 43.5,10.25 arc90 44.05,9.7 57.32,9.7 arc-90 v57.79,9.23
INPUT0B  (via drill 0.5 pad 0.25)
  Top 0.254: R25.2 arc-90 56.03,8.66 v56.39,8.66 | AMUX0.P$10 55.79,21.59 arc90 v56.19,21.19
  Route15 0.254: v56.39,8.66 arc90 55.9,9.15 44.1,9.15 arc-90 42.95,10.3 42.95,40.2 arc-90 43.6,40.85 56.9,40.85 arc-90 57.7,40.05 57.7,27.99 arc90 58.08,27.61 arc-90 58.36,27.33 58.36,23.36 arc-90 v56.19,21.19
INPUT1A  (via drill 0.5 pad 0.25)
  Top 0.254: v74.45,24.83 AMUX1.P$1 arc90 AMUX1.P$1 | R24.2 51.53,7.66 arc-90 v51.51,7.68
  Route15 0.254: v74.45,24.83 74.45,29.55 arc-90 75.73,30.83 78.47,30.83 arc90 79.99,32.35 79.99,34.53 arc90 78.47,36.05 61.3,36.05 arc-90 59.1,38.25 59.1,40.05 arc90 57.75,41.4 43.6,41.4 arc90 42.35,40.15 42.35,10.25 arc90 44.05,8.55 arc-90 44.06,8.56 50.98,8.56 arc-90 51.51,8.03 v51.51,7.68
INPUT1B  (via drill 0.5 pad 0.25)
  Top 0.254: R26.1 46.21,7.51 arc-90 v46.19,7.53 | v79.19,24.92 arc-90 79.46,24.65 AMUX1.P$10
  Route15 0.254: v46.19,7.53 44.37,7.53 arc-90 44.35,7.55 arc-90 41.65,10.25 41.65,40.1 arc-90 43.65,42.1 57.75,42.1 arc-90 59.8,40.05 59.8,38.4 arc90 59.85,38.35 arc90 61.5,36.7 78.76,36.7 arc-90 80.66,34.8 80.66,30.73 arc-90 79.75,29.82 arc90 79.19,29.26 v79.19,24.92
N$1
  Top 0.254: AD9201.3 69.6,42.35 arc-90 70.05,42.8 70.76,42.8 arc90 R4.1
N$2
  Top 0.254: R5.1 arc90 71.1,46.44 71.1,44 68.95,42.85 AD9201.4
N$3  (via drill 0.5 pad 0.25)
  Top 0.254: AMUX0.P$2 61.27,22.63 arc-90 v62.01,21.89
  Route15 0.254: v62.01,21.89 62.01,21.58 arc-90 58.8,18.37 arc90 56.91,16.48 J2.8
N$4  (via drill 0.5 pad 0.25, 1 pad 1.27)
  Top 0.254: AD9201.17 63.75,32.25 arc-90 62.35,30.85 arc123 C6.2 arc-66 C30.2 arc90 61.9,28.76 61.9,26.5 arc90 63.36,25.04 arc90 63.36,25.04 R22.1 | v67.83,23.22 arc-90 67.17,23.88 arc90 66.02,25.04 R22.1 | v67.84,26.88 arc-90 69.25,25.46 R1.2 arc-90 69.24,25.04 R22.1 | AD9201.26 69.6,32.12 arc90 v71.53,30.19
  Route15 0.254: v71.53,30.19 arc-90 68.22,26.88 v67.84,26.88 | v67.83,23.22 67.83,22.42 arc-90 67.02,21.61 arc90 65.8,20.39 65.8,14.25 arc90 66.47,13.58 J2.13 J2.14 J2.15 J2.16
N$5  (via drill 0.5 pad 0.25, 1 pad 1.27)
  Top 0.254: AD9201.22 67,34.65 arc-90 v67.3,34.95 | v69.65,29.75 C5.2 arc90 C5.2 C29.2 arc-90 70.14,27.21 R1.1 arc90 70.22,24.98 v72.26,24.98
  Route15 0.254: v67.3,34.95 67.75,34.95 arc-90 68.25,34.45 68.25,31.15 arc90 v69.65,29.75
N$6
  Top 0.254: AD9201.18 C31.1 C28.1 C13.2
N$7
  Top 0.254: AD9201.19 65.05,32.45 C31.2 C28.2 C7.2
N$8
  Top 0.254: AMUX0.P$9 56.52,22.63 arc-90 57.9,21.25 57.9,20.3 arc90 59,19.2 arc-90 59.45,18.75 J2.7
N$9
  Top 0.254: R25.1 55.37,4.93 arc90 U$2.P9.30
  Route15 0.254: U$2.P9.26 arc90 51.95,3.26 54.47,3.26 arc90 U$2.P9.30
N$10
  Top 0.254: AMUX1.P$8 arc90 AMUX1.P$8 80.4,22.72 arc90 80.87,23.19 80.87,27.52 arc-90 R14.2
N$11
  Top 0.254: AD9201.16 63.1,32.35 arc-90 62.45,31.7 arc90 62.45,31.7 C32.2 arc90 C32.2 R15.1 55.65,31.76 R3.1
N$12
  Top 0.254: AD9201.5 68.3,42.85 R6.1
N$13
  Top 0.254: AD9201.6 arc90 AD9201.6 67.7,42.9 R7.1
N$14
  Top 0.254: AD9201.7 R8.1
N$15
  Top 0.254: AD9201.8 R9.1
N$16
  Top 0.254: AD9201.9 65.7,43.13 R10.1
N$17
  Top 0.254: AD9201.10 65.05,42.05 63.31,43.79 R11.1
N$18
  Top 0.254: AD9201.11 64.4,41.6 62.04,43.96 R12.1
N$19
  Top 0.254: AD9201.12 63.75,41.15 60.75,44.15 60.75,46.76 R13.1
N$20
  Top 0.254: J1.1 27.07,46.58 arc90 U$4.P3
N$21
  Route15 0.254: U$2.P9.31 arc90 59.55,3.27 59.55,6 arc90 59.1,6.45 39.35,6.45 arc-90 39.3,6.5 39.3,31.6 arc90 36,34.9 34.45,34.9 arc-90 30.43,38.92 J1.3
N$22
  Top 0.254: AMUX0.P$8 55.06,23.13 arc-90 54.67,23.52 54.67,24.95 arc-90 54.69,24.97 54.69,31.57 arc-90 R15.2
N$23
  Top 0.254: AD9201.27 70.25,32.15 arc90 70.6,31.8 74.19,31.8 arc90 C4.2 77.47,31.87 arc-90 R14.1 arc-90 R14.1 R2.1
N$24
  Top 0.254: R27.2 arc90 57.01,6.44 57.01,3.27 arc-90 U$2.P9.29
N$25  (via drill 0.5 pad 0.25)
  Top 0.254: AMUX0.P$4 61.5,23.63 arc90 61.76,23.89 61.76,23.98 arc-90 v62.01,24.23
  Route15 0.254: v62.01,24.23 62.35,24.23 arc-90 62.93,23.65 62.93,17.06 arc-90 J2.6
N$26
  Top 0.254: AMUX0.P$7 56.58,23.63 arc-90 58.66,21.55 arc90 60.99,19.22 63.15,19.22 arc-90 64.52,17.85 J2.5 arc90 J2.5
N$27
  Top 0.254: D1.+ R19.2
N$28
  Top 0.254: RAW1.1 81.4,21.49 arc-90 J5.1 82.03,26.56 arc-90 R2.2
N$29
  Top 0.254: AMUX1.P$4 74.39,22.23 arc90 72.14,19.98 J2.2 arc90 J2.2
N$30
  Top 0.254: D3.- 47.8,43.21 R28.2
N$33
  Top 0.254: R21.2 D2.-
N$34  (via drill 0.5 pad 0.25)
  Top 0.254: v53.35,33.2 R3.2 | 50.16,20.53 arc-90 v50.15,20.52 50.15,23.12 arc90 J6.1
  Route15 0.254: v53.35,33.2 arc90 50.15,30.55 v50.15,20.52 RAW0.1
N$35
  Top 0.254: R18.2 35.47,37.07 arc-90 J4.2
N$36
  Top 0.254: U$3.2 30.07,29.58 arc90 U2.3
N$37
  Top 0.254: U3.3 32.27,15.56 arc90 U$1.2
N$38
  Top 0.254: R24.1 U$2.P9.28
N$39
  Top 0.254: R26.2 48.96,7.51 arc-90 51.94,4.53 51.94,3.28 arc90 U$2.P9.27
N$40
  Top 0.254: J5.2 84.57,24.6 arc-90 R17.2
N$41
  Top 0.254: J6.2 R23.2 arc90 R23.2
N$44
  Top 0.254: AMUX1.P$2 73.8,23.23 arc90 71.41,20.84 arc-101 70.2,19.84 arc90 67.07,16.71 J2.4
N$46  (via drill 0.5 pad 0.25)
  Top 0.254: J2.3 69.61,17.28 arc-90 v70.82,18.49 | v78.03,23.27 79.42,23.27 arc-90 AMUX1.P$9
  Route15 0.254: v70.82,18.49 73.25,18.49 arc90 v78.03,23.27
N$47
  Top 0.254: AMUX1.P$7 arc90 AMUX1.P$7 78.12,22.24 arc90 76.6,20.72 76.6,17.9 arc-90 74.82,16.12 J2.1
OTHERSYS5V
  Top 0.254: 27.8,2.01 U$2.P9.7 U$2.P9.8 27.81,6.46 | 27.81,6.46 arc-90 L2.1 | L1.2 26.28,7.99 arc-90 27.81,6.46
SYS5V
  Top 0.254: U$1.1 32.32,13.45 arc-90 31.33,12.46 28,12.46 arc90 27.81,12.27 27.81,10.74 arc90 L2.2
  Top 0.406: 28.55,15.1 arc90 28.89,15.44 U3.1 C26.2 arc90 C26.2 C24.+ arc-90 C24.+
  Top 1.27: 27.81,12.27 27.81,14.36 arc-90 28.55,15.1
SYS5V_2
  Top 0.254: R19.1 20.77,9.75 arc90 21.95,10.93 arc90 23.37,9.51 L1.1 | 21.95,27.52 arc-90 C25.+ | U$3.1 31.54,27.99 arc-90 29.05,25.5 23.7,25.5 arc90 21.95,23.75
  Top 0.61: C25.+ 25.3,28.92 arc90 C27.2 U2.1 arc90 U2.1
  Top 1.27: 21.95,10.93 21.95,23.75 21.95,27.52

### Text on the board
tNames: 20MHz osc | GPIO Clock | clock source | AVCC | 1 | AGND | INPUTS 0..7 | enabled | PRUDAQ V5.0 | AGND | VREF | powered